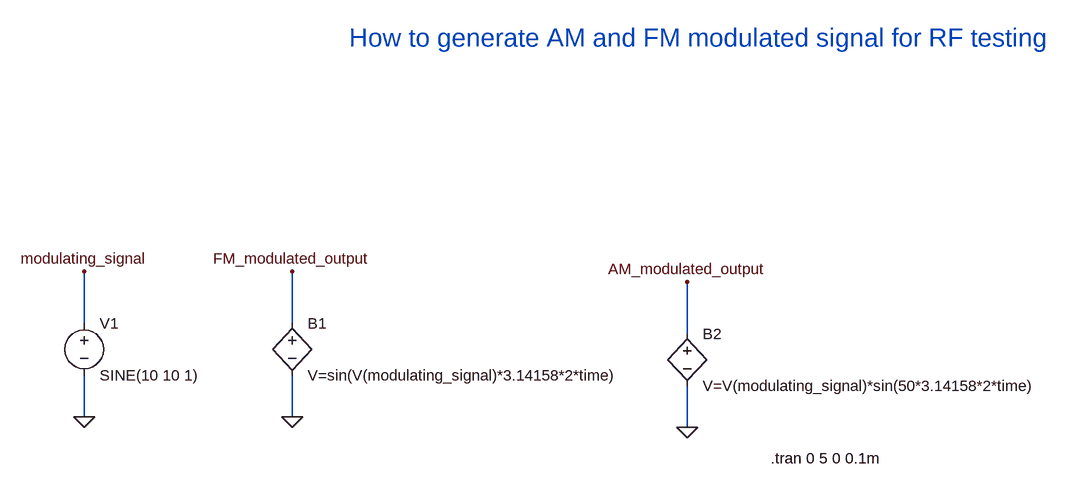
[diagram p0: schematic AM-FM-signals-sources.asc]
AM-FM-signals-sources.asc, the LTspice schematic file:
Version 4
SHEET 1 1576 680
WIRE 32 176 32 96
WIRE 352 176 352 96
WIRE 960 192 960 112
WIRE 32 320 32 256
WIRE 352 320 352 256
WIRE 960 336 960 272
FLAG 32 320 0
FLAG 352 320 0
FLAG 32 96 modulating_signal
FLAG 960 336 0
FLAG 352 96 FM_modulated_output
FLAG 960 112 AM_modulated_output
SYMBOL voltage 32 160 R0
WINDOW 123 0 0 Left 0
WINDOW 39 0 0 Left 0
SYMATTR InstName V1
SYMATTR Value SINE(10 10 1)
SYMBOL bv 352 160 R0
SYMATTR InstName B1
SYMATTR Value V=sin(V(modulating_signal)*3.14158*2*time)
SYMBOL bv 960 176 R0
SYMATTR InstName B2
SYMATTR Value V=V(modulating_signal)*sin(50*3.14158*2*time)
TEXT 1088 384 Left 2 !.tran 0 5 0 0.1m
TEXT 440 -264 Left 4 ;How to generate AM and FM modulated signal for RF testing

The netlist it stands for:
* AM-FM-signals-sources.asc
V1 modulating_signal 0 SINE(10 10 1)
B1 FM_modulated_output 0 V=sin(V(modulating_signal)*3.14158*2*time)
B2 AM_modulated_output 0 V=V(modulating_signal)*sin(50*3.14158*2*time)
.tran 0 5 0 0.1m
* How to generate AM and FM modulated signal for RF testing
.backanno
.end